# Altium schematic sheet s2.SchDoc
size B
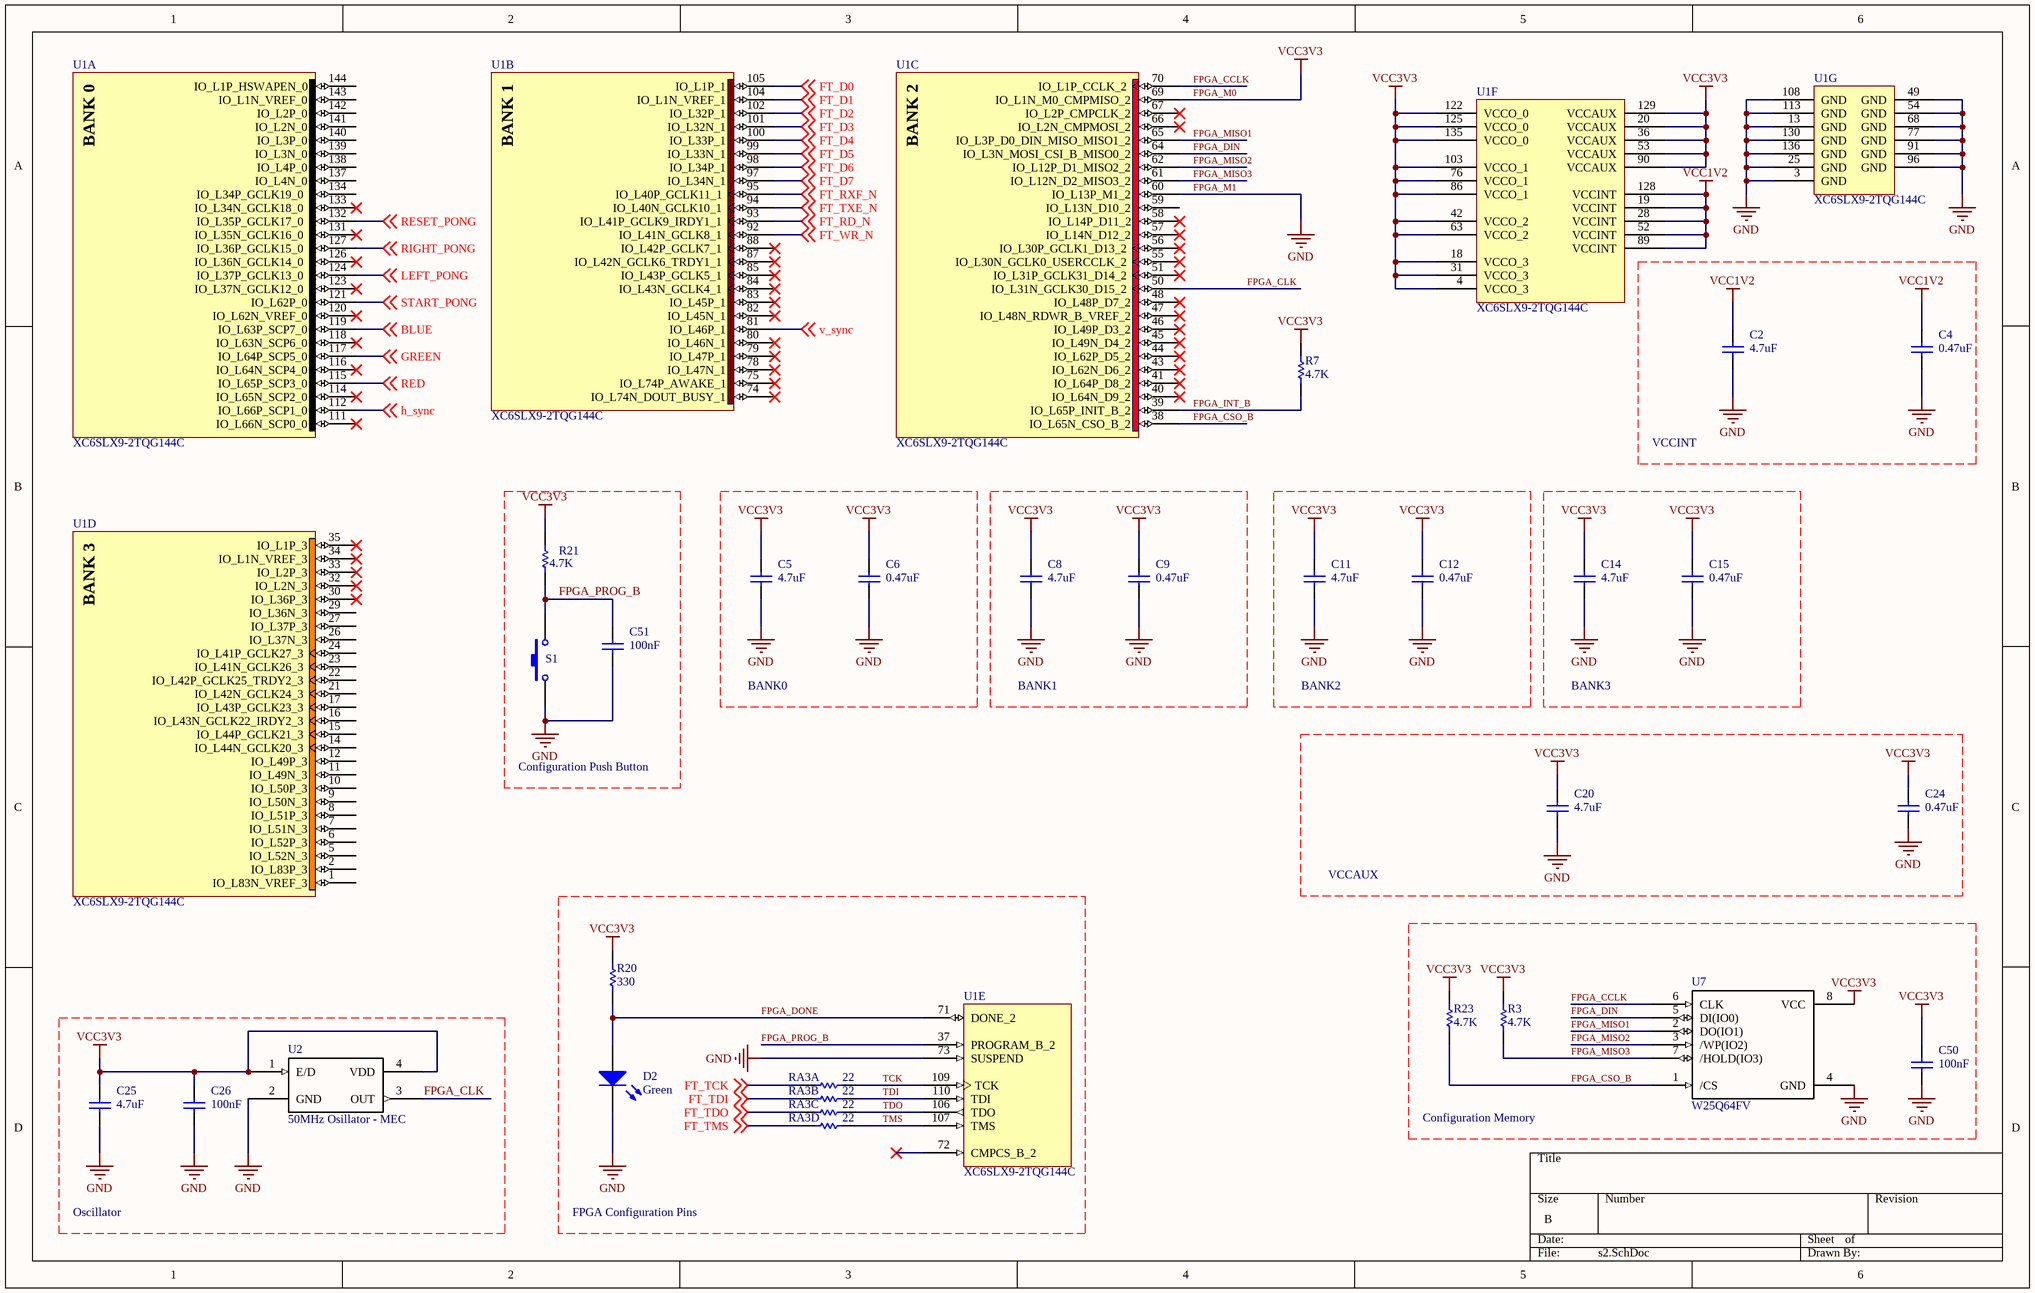
[diagram p0: s2.SchDoc]

## Parts
C2  value 4.7uF  [0805 CAP]  (hidden comment: Cap)
C4  value 0.47uF  [0805 CAP]  (hidden comment: Cap)
C5  value 4.7uF  [0805 CAP]  (hidden comment: Cap)
C6  value 0.47uF  [0805 CAP]  (hidden comment: Cap)
C8  value 4.7uF  [0805 CAP]  (hidden comment: Cap)
C9  value 0.47uF  [0805 CAP]  (hidden comment: Cap)
C11  value 4.7uF  [0805 CAP]  (hidden comment: Cap)
C12  value 0.47uF  [0805 CAP]  (hidden comment: Cap)
C14  value 4.7uF  [0805 CAP]  (hidden comment: Cap)
C15  value 0.47uF  [0805 CAP]  (hidden comment: Cap)
C20  value 4.7uF  [0805 CAP]  (hidden comment: Cap)
C24  value 0.47uF  [0805 CAP]  (hidden comment: Cap)
C25  value 4.7uF  [0805 CAP]  (hidden comment: Cap)
C26  value 100nF  [0805 CAP]  (hidden comment: Cap)
C50  value 100nF  [0805 CAP]  (hidden comment: Cap)
C51  value 100nF  [0805 CAP]  (hidden comment: Cap)
D2  Green  [0805 LED]
R3  value 4.7K  [0805 RES]  (hidden comment: Res1)
R7  value 4.7K  [0805 RES]  (hidden comment: Res1)
R20  value 330  [0805 RES]  (hidden comment: Res1)
R21  value 4.7K  [0805 RES]  (hidden comment: Res1)
R23  value 4.7K  [0805 RES]  (hidden comment: Res1)
RA3A  value 22  [0805 RES]  (hidden comment: Res1)
RA3B  value 22  [0805 RES]  (hidden comment: Res1)
RA3C  value 22  [0805 RES]  (hidden comment: Res1)
RA3D  value 22  [0805 RES]  (hidden comment: Res1)
S1  SW-PB  [Tack Switch]  (value not drawn)
U1  XC6SLX9-2TQG144C  [TQG144_M]  (parts A,B,C,D,E,F,G of 7)
U2  50MHz Osillator - MEC  [50MHz Osillator - MEC]
U7  W25Q64FV  [SO08 - duplicate]

## Nets
FPGA_M0: C5.2 C6.2 C8.2 C9.2 C11.2 C12.2 C14.2 C15.2 C20.2 C24.2 C25.2 C26.2 C50.2 R3.2 R7.2 R20.2 R21.2 R23.2 U1.4(VCCO_3) U1.18(VCCO_3) U1.20(VCCAUX) U1.31(VCCO_3) U1.36(VCCAUX) U1.42(VCCO_2) U1.53(VCCAUX) U1.63(VCCO_2) U1.69(IO_L1N_M0_CMPMISO_2) U1.76(VCCO_1) U1.86(VCCO_1) U1.90(VCCAUX) U1.103(VCCO_1) U1.122(VCCO_0) U1.125(VCCO_0) U1.129(VCCAUX) U1.135(VCCO_0) U2.1(E/D) U2.4(VDD) U7.8(VCC)  [also labelled VCC3V3]
FPGA_M1: C2.1 C4.1 C5.1 C6.1 C8.1 C9.1 C11.1 C12.1 C14.1 C15.1 C20.1 C24.1 C25.1 C26.1 C50.1 C51.1 D2.2(K) S1.1 U1.3(GND) U1.13(GND) U1.25(GND) U1.49(GND) U1.54(GND) U1.60(IO_L13P_M1_2) U1.68(GND) U1.73(SUSPEND) U1.77(GND) U1.91(GND) U1.96(GND) U1.108(GND) U1.113(GND) U1.130(GND) U1.136(GND) U2.2(GND) U7.4(GND)  [also labelled GND]
VCC1V2: C2.2 C4.2 U1.19(VCCINT) U1.28(VCCINT) U1.52(VCCINT) U1.89(VCCINT) U1.128(VCCINT)
BLUE: U1.119(IO_L63P_SCP7_0) ; off-sheet BLUE
FPGA_CCLK: U1.70(IO_L1P_CCLK_2) U7.6(CLK)
FPGA_CLK: U1.50(IO_L31N_GCLK30_D15_2) U2.3(OUT)
FPGA_CSO_B: R23.1 U1.38(IO_L65N_CSO_B_2) U7.1(/CS)
FPGA_DIN: U1.64(IO_L3N_MOSI_CSI_B_MISO0_2) U7.5(DI(IO0))
FPGA_DONE: D2.1(A) R20.1 U1.71(DONE_2)
FPGA_INT_B: R7.1 U1.39(IO_L65P_INIT_B_2)
FPGA_MISO1: U1.65(IO_L3P_D0_DIN_MISO_MISO1_2) U7.2(DO(IO1))
FPGA_MISO2: U1.62(IO_L12P_D1_MISO2_2) U7.3(/WP(IO2))
FPGA_MISO3: R3.1 U1.61(IO_L12N_D2_MISO3_2) U7.7(/HOLD(IO3))
FPGA_PROG_B: C51.2 R21.1 S1.2 U1.37(PROGRAM_B_2)
FT_D0: U1.105(IO_L1P_1) ; off-sheet FT_D0
FT_D1: U1.104(IO_L1N_VREF_1) ; off-sheet FT_D1
FT_D2: U1.102(IO_L32P_1) ; off-sheet FT_D2
FT_D3: U1.101(IO_L32N_1) ; off-sheet FT_D3
FT_D4: U1.100(IO_L33P_1) ; off-sheet FT_D4
FT_D5: U1.99(IO_L33N_1) ; off-sheet FT_D5
FT_D6: U1.98(IO_L34P_1) ; off-sheet FT_D6
FT_D7: U1.97(IO_L34N_1) ; off-sheet FT_D7
FT_RD_N: U1.93(IO_L41P_GCLK9_IRDY1_1) ; off-sheet FT_RD_N
FT_RXF_N: U1.95(IO_L40P_GCLK11_1) ; off-sheet FT_RXF_N
FT_TCK: RA3A.2 ; off-sheet FT_TCK
FT_TDI: RA3B.2 ; off-sheet FT_TDI
FT_TDO: RA3C.2 ; off-sheet FT_TDO
FT_TMS: RA3D.2 ; off-sheet FT_TMS
FT_TXE_N: U1.94(IO_L40N_GCLK10_1) ; off-sheet FT_TXE_N
FT_WR_N: U1.92(IO_L41N_GCLK8_1) ; off-sheet FT_WR_N
GREEN: U1.117(IO_L64P_SCP5_0) ; off-sheet GREEN
h_sync: U1.112(IO_L66P_SCP1_0) ; off-sheet h_sync
LEFT_PONG: U1.124(IO_L37P_GCLK13_0) ; off-sheet LEFT_PONG
RED: U1.115(IO_L65P_SCP3_0) ; off-sheet RED
RESET_PONG: U1.132(IO_L35P_GCLK17_0) ; off-sheet RESET_PONG
RIGHT_PONG: U1.127(IO_L36P_GCLK15_0) ; off-sheet RIGHT_PONG
START_PONG: U1.121(IO_L62P_0) ; off-sheet START_PONG
TCK: RA3A.1 U1.109(TCK)
TDI: RA3B.1 U1.110(TDI)
TDO: RA3C.1 U1.106(TDO)
TMS: RA3D.1 U1.107(TMS)
v_sync: U1.81(IO_L46P_1) ; off-sheet v_sync

Not connected (* = marked no-connect by the designer): U1 1(IO_L83N_VREF_3) 2(IO_L83P_3) 5(IO_L52N_3) 6(IO_L52P_3) 7(IO_L51N_3) 8(IO_L51P_3) 9(IO_L50N_3) 10(IO_L50P_3) 11(IO_L49N_3) 12(IO_L49P_3) 14(IO_L44N_GCLK20_3) 15(IO_L44P_GCLK21_3) 16(IO_L43N_GCLK22_IRDY2_3) 17(IO_L43P_GCLK23_3) 21(IO_L42N_GCLK24_3) 22(IO_L42P_GCLK25_TRDY2_3) 23(IO_L41N_GCLK26_3) 24(IO_L41P_GCLK27_3) 26(IO_L37N_3) 27(IO_L37P_3) 29(IO_L36N_3) 30(IO_L36P_3)* 32(IO_L2N_3)* 33(IO_L2P_3)* 34(IO_L1N_VREF_3)* 35(IO_L1P_3)* 40(IO_L64N_D9_2)* 41(IO_L64P_D8_2)* 43(IO_L62N_D6_2)* 44(IO_L62P_D5_2)* 45(IO_L49N_D4_2)* 46(IO_L49P_D3_2)* 47(IO_L48N_RDWR_B_VREF_2)* 48(IO_L48P_D7_2)* 51(IO_L31P_GCLK31_D14_2)* 55(IO_L30N_GCLK0_USERCCLK_2)* 56(IO_L30P_GCLK1_D13_2)* 57(IO_L14N_D12_2)* 58(IO_L14P_D11_2)* 59(IO_L13N_D10_2) 66(IO_L2N_CMPMOSI_2)* 67(IO_L2P_CMPCLK_2)* 72(CMPCS_B_2)* 74(IO_L74N_DOUT_BUSY_1)* 75(IO_L74P_AWAKE_1)* 78(IO_L47N_1)* 79(IO_L47P_1)* 80(IO_L46N_1)* 82(IO_L45N_1)* 83(IO_L45P_1)* 84(IO_L43N_GCLK4_1)* 85(IO_L43P_GCLK5_1)* 87(IO_L42N_GCLK6_TRDY1_1)* 88(IO_L42P_GCLK7_1)* 111(IO_L66N_SCP0_0)* 114(IO_L65N_SCP2_0)* 116(IO_L64N_SCP4_0)* 118(IO_L63N_SCP6_0)* 120(IO_L62N_VREF_0)* 123(IO_L37N_GCLK12_0)* 126(IO_L36N_GCLK14_0)* 131(IO_L35N_GCLK16_0)* 133(IO_L34N_GCLK18_0)* 134(IO_L34P_GCLK19_0) 137(IO_L4N_0) 138(IO_L4P_0) 139(IO_L3N_0) 140(IO_L3P_0) 141(IO_L2N_0) 142(IO_L2P_0) 143(IO_L1N_VREF_0) 144(IO_L1P_HSWAPEN_0)

## Notes on the sheet
- VCCINT
- BANK0
- BANK1
- BANK2
- BANK3
- Configuration Push Button
- VCCAUX
- Configuration Memory
- Oscillator
- FPGA Configuration Pins
- (in symbol XC6SLX9-2TQG144C, part A) BANK 0
- (in symbol XC6SLX9-2TQG144C, part B) BANK 1
- (in symbol XC6SLX9-2TQG144C, part C) BANK 2
- (in symbol XC6SLX9-2TQG144C, part D) BANK 3

## Library data of the parts
C2 C4-C6 C8 C9 C11 C12 C14 C15 C20 C24-C26 C50 C51 = Cap: Capacitor; Published: 8-Jun-2000; LatestRevisionDate: 17-Jul-2002; LatestRevisionNote: Re-released for DXP Platform.; PackageReference: RAD-0.3; Publisher: Altium Limited; PackageDescription: Radial Cap, Thru-Hole; 2 Leads; 0.3 in Pin Spacing
D2 = LED0: Typical INFRARED GaAs LED; Published: 8-Jun-2000; LatestRevisionDate: 08-Jul-2005; LatestRevisionNote: Mech Layer 1 removed.; PackageReference: LED-0; Publisher: Altium Limited; PackageDescription: LED; 2 Leads
R3 R7 R20 R21 R23 RA3A RA3B RA3C RA3D = Res1: Resistor; Published: 8-Jun-2000; LatestRevisionDate: 17-Jul-2002; LatestRevisionNote: Re-released for DXP Platform.; PackageReference: AXIAL-0.3; Publisher: Altium Limited; PackageDescription: Axial Device, Thru-Hole; 2 Leads; 0.3 in Pin Spacing
S1 = SW-PB: Switch; pin to pad: 2>3; Published: 24-Mar-1999; LatestRevisionDate: 17-Jul-2002; LatestRevisionNote: Re-released for DXP Platform.; PackageReference: SPST-2; Publisher: Altium Limited; PackageDescription: Switch; 2 Leads
U1 = XC6SLX9-2TQG144C: Spartan-6 LX 1.2V FPGA, 102 User I/Os, 144-Pin TQFP (0.5mm Pitch), Speed Grade 2, Commercial Grade, Pb-Free; DatasheetVersion: ver1.6, Nov-2010; PackageVersion: ver1.2, Jun-2004; PackageReference: TQG144; PackageDescription: 144-Pin Thin Quad Flat Pack (TQG144) - Pb-Free; Code_JEDEC: MS-026-BFB; ComponentLink1Description: Manufacturer URL; ComponentLink1URL: http://www.xilinx.com/; ComponentLink2Description: Spartan-6 Datasheet; ComponentLink2URL: http://www.xilinx.com/support/documentation/data_sheets/ds160.pdf; ComponentLink3Description: Spartan-6 Documents; ComponentLink3URL: http://www.xilinx.com/support/documentation/spartan-6.htm